# Altium schematic sheet Nor Flash QSPI.SchDoc
size A4; SheetNumber: 5; SheetTotal: 16
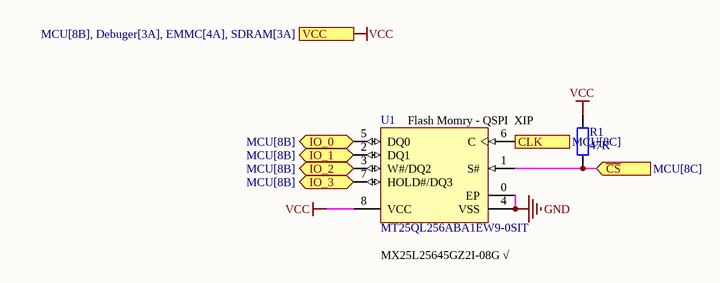
[diagram p0: Nor Flash QSPI.SchDoc]

## Parts
R1  47K  [0402-R]
U1  MT25QL256ABA1EW9-0SIT  [WSON8]

## Ports
CLK (in, see MCU[8C]), IO_0 (bidir, see MCU[8B]), IO_1 (bidir, see MCU[8B]), IO_2 (bidir, see MCU[8B]), IO_3 (bidir, see MCU[8B]), VCC (see MCU[8B], Debuger[3A], EMMC[4A], SDRAM[3A]), ~{CS} (in, see MCU[8C])

## Nets
GND: U1.0(EP) U1.4(VSS)
VCC: R1.1 U1.8(VCC) ; port VCC
~{CS}: R1.2 U1.1(S#) ; port ~{CS}
CLK: U1.6(C) ; port CLK
IO_0: U1.5(DQ0) ; port IO_0
IO_1: U1.2(DQ1) ; port IO_1
IO_2: U1.3(W#/DQ2) ; port IO_2
IO_3: U1.7(HOLD#/DQ3) ; port IO_3

## Notes on the sheet
- (near U1) Flash Momry - QSPI  XIP
- (near U1) MX25L25645GZ2I-08G √

## Library data of the parts
R1 = R: 贴片电阻; 联系卖家，免费查找封装: 唯一出售店铺网址https://shop463601444.taobao.com; BOM名称: 贴片电阻
U1 = MT25QL256ABA1EW9-0SIT: Micron Serial NOR Flash Memory, 2.7 to 3.6 V, 256 Mb, -40 to 85 degC, 8-Pin W-PDFN (W9), RoHS; Manufacturer: Micron Technology; Datasheet URL: https://www.micron.com/~/media/documents/products/data-sheet/nor-flash/serial-nor/mt25q/die-rev-a/mt25q_qljs_l_256_aba_0.pdf; Manufacturer URL: http://www.micron.com/; RoHSCompliant: true; Datasheet Version: Rev. I, 07/2017; Mounting Technology: SurfaceMount; Package Reference: W9; Package Description: 8-Pin Plastic Dual Flat No-lead Package, Body 8 x 6 mm, Pitch 1.27 mm; Manufacturer Part Number: MT25QL256ABA1EW9-0SIT